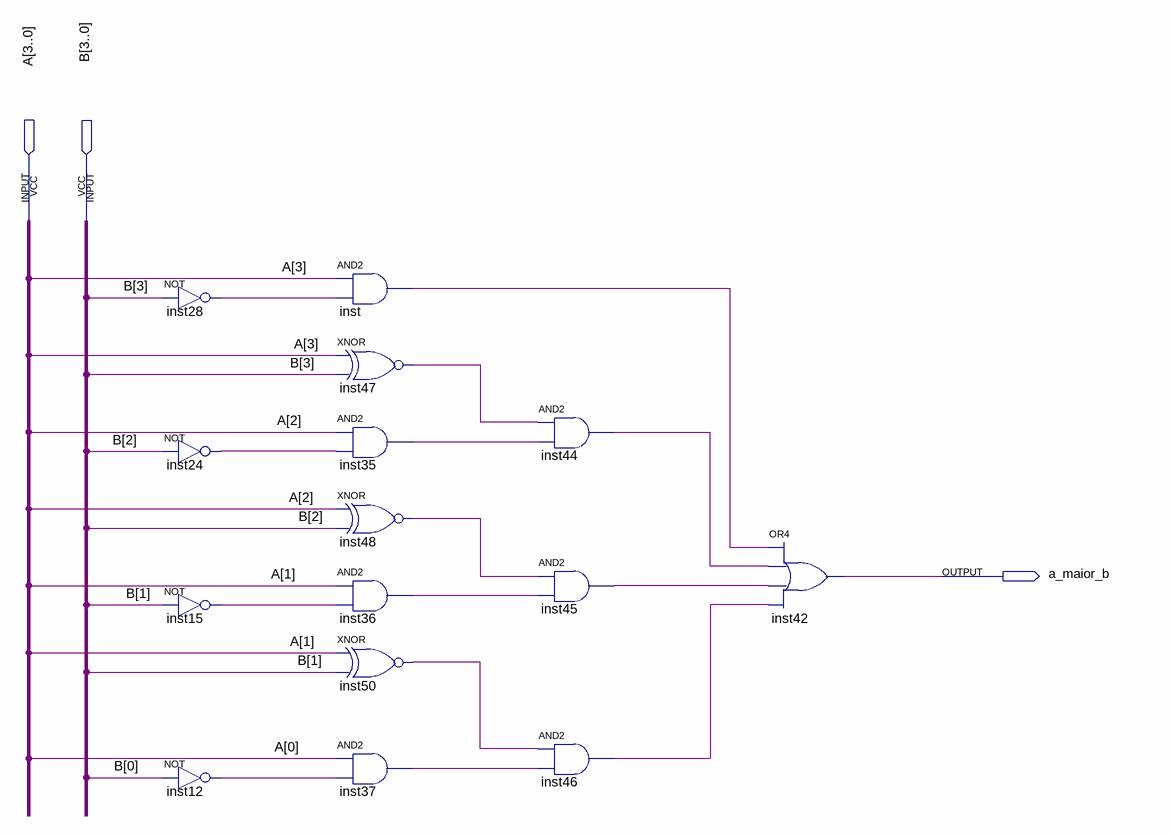
[diagram p0: schematic sheet]
// Quartus schematic a_maiorque_b.bdf as structural Verilog: 15 symbols, 3 pins
module a_maiorque_b (
  input  [3:0] A,
  input  [3:0] B,
  output a_maior_b
);

  wire inst12_out, inst15_out, inst24_out, inst28_out, inst35_out, inst36_out, inst37_out, inst44_out,
       inst45_out, inst46_out, inst47_out, inst48_out, inst50_out, inst_out;

  not inst28 (inst28_out, B[3]);
  not inst24 (inst24_out, B[2]);
  not inst15 (inst15_out, B[1]);
  not inst12 (inst12_out, B[0]);
  and inst (inst_out, A[3], inst28_out);
  xnor inst47 (inst47_out, A[3], B[3]);
  and inst35 (inst35_out, A[2], inst24_out);
  xnor inst48 (inst48_out, A[2], B[2]);
  and inst36 (inst36_out, A[1], inst15_out);
  xnor inst50 (inst50_out, A[1], B[1]);
  and inst37 (inst37_out, A[0], inst12_out);
  and inst44 (inst44_out, inst47_out, inst35_out);
  and inst45 (inst45_out, inst48_out, inst36_out);
  and inst46 (inst46_out, inst50_out, inst37_out);
  or inst42 (a_maior_b, inst_out, inst44_out, inst45_out, inst46_out);
endmodule
